# EAGLE board Zuino XS PsyFi32 (EAGLE 8.4.1), part 1 of 2
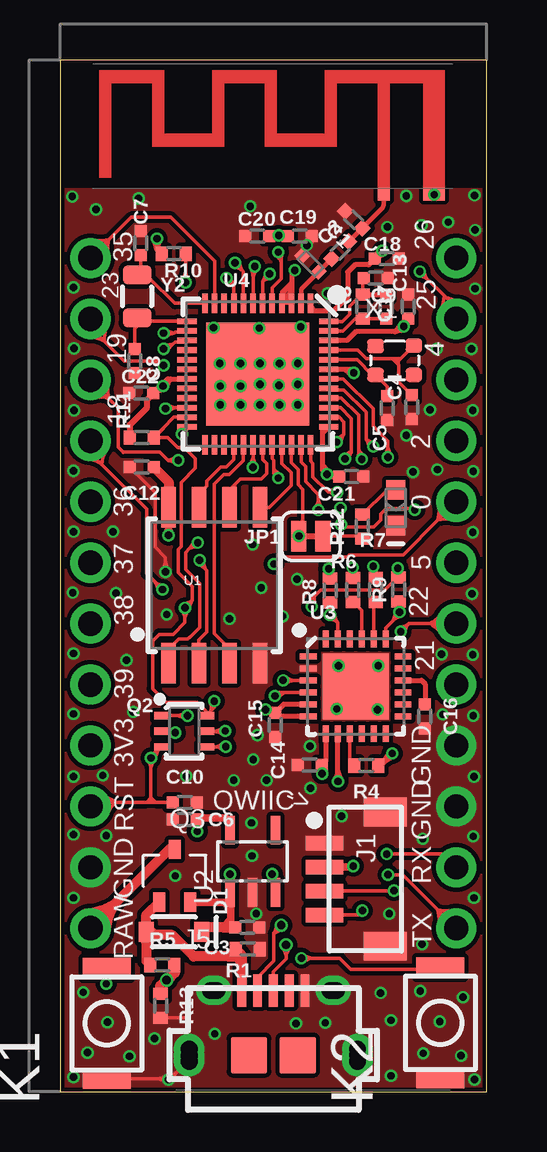
[diagram p1: board, top side]
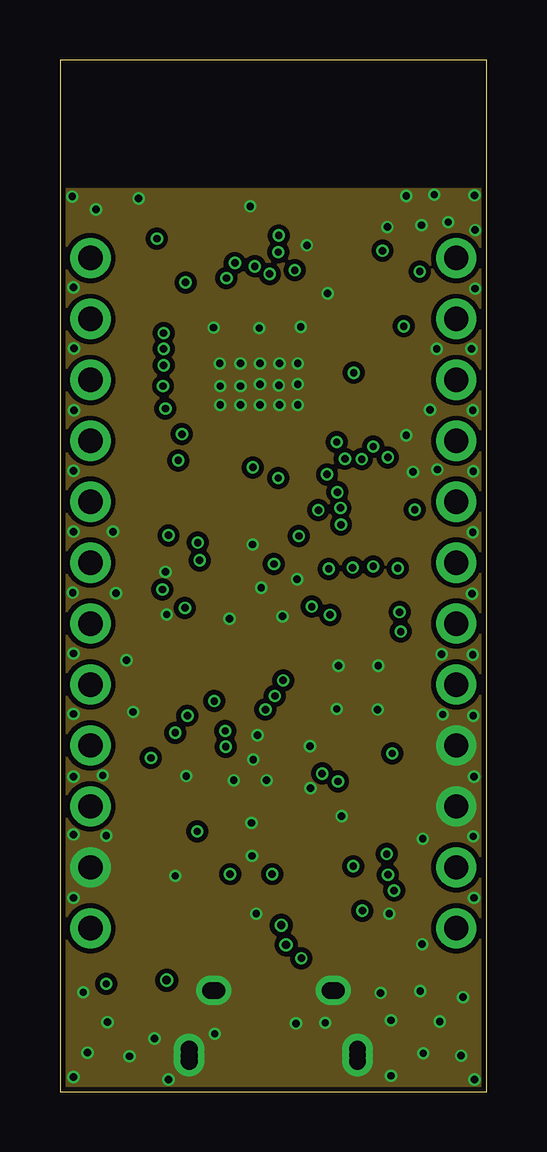
[diagram p2: board, inner layer Route2]
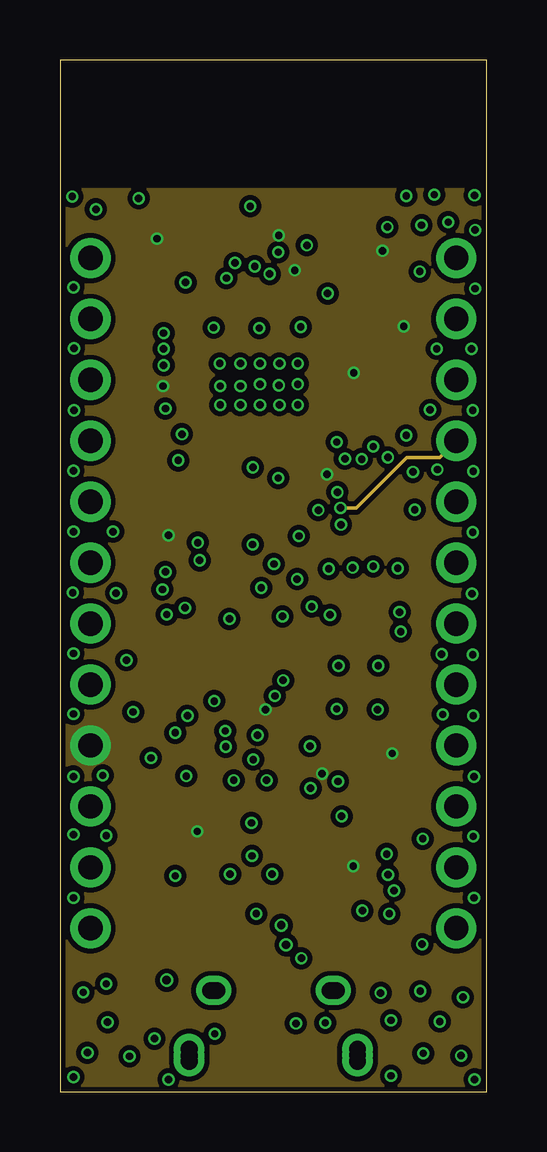
[diagram p3: board, inner layer Route15]
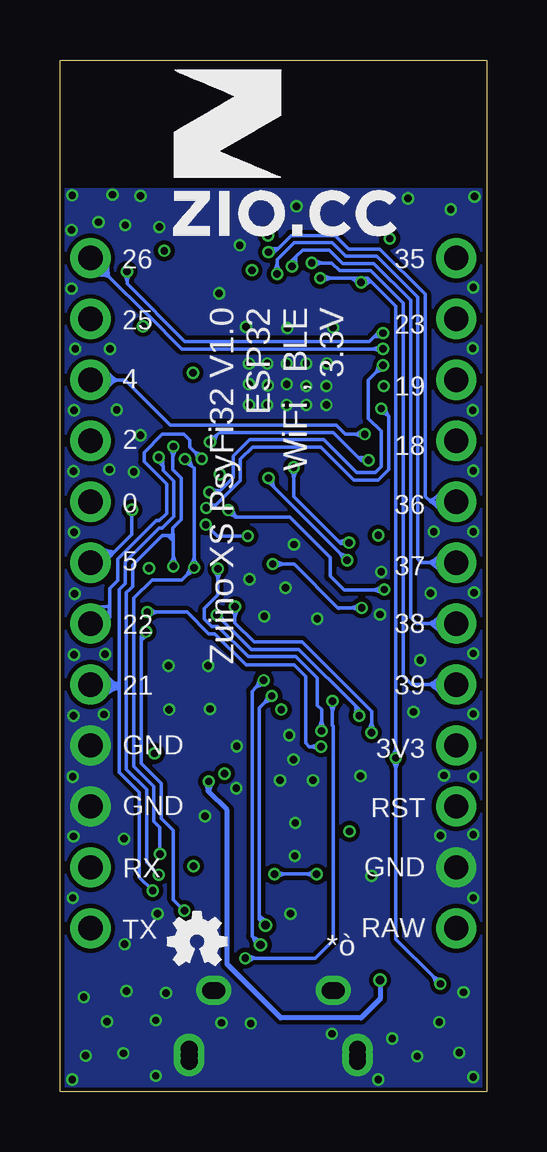
[diagram p4: board, bottom side, seen from below]

Size 17.78 x 43.01 mm. Coordinates in mm from the lower left corner, seen from the top.
Outline: 0,0 17.78,0 17.78,43.01 0,43.01 0,0
Copper layers (1*2+15*16): Top 0.035mm / dielectric 0.12mm / Route2 0.0175mm / dielectric 1.2mm / Route15 0.0175mm / dielectric 0.12mm / Bottom 0.035mm
Design rules "Eagle Rule_4layer": minimum track width 6mil, minimum drill 12mil, track to track 6mil, track to pad 6mil, pad to pad 6mil, via to via 6mil, smd to smd 0mil, copper to edge 6mil, drill to drill 12mil, minimum pad ring 10mil, minimum via ring 4mil, stop-mask expansion 2mil, vias tented up to drill 25mil, thermal gap 10mil
tRestrict: 4 lines

## Footprints (pad centres in the part's own frame; a part is rotated, then mirrored left to right if it is on the bottom)
YAGEO_C_0402 = smd 0.5 x 0.5: 1 -0.5,0; 2 0.5,0
SOD-323 = smd 0.63 x 0.83: A 1.15,0; C -1.15,0
LED_HSMH-C190 = smd 0.8 x 0.8: 1 0.75,0; 2 -0.75,0
ANTENNA_ESP32 = smd 0.5 x 0.5: ANT 5.61,-2.49 | smd 0.9 x 0.5: GND 7.71,-2.49
JST-SH-4P-90 = smd 0.6 x 1.55: 1 -1.5,0; 2 -0.5,0; 3 0.5,0; 4 1.5,0 | smd 1.2 x 1.8: 5 -2.8,2.525; 6 2.8,2.525
1X12 = drill 1.016 pad 1.676: 1 0,0; 2 2.54,0; 3 5.08,0; 4 7.62,0; 5 10.16,0; 6 12.7,0; 7 15.24,0; 8 17.78,0; 9 20.32,0; 10 22.86,0; 11 25.4,0; 12 27.94,0
MICRO-SMD = smd 0.406 x 1.346: D+ 0,2.057; D- -0.66,2.057; GND 1.321,2.057; ID 0.66,2.057; VBUS -1.321,2.057 | drill 0.7: S1 -2.489,2.057; S1@1 -2.616,2.057; S1@2 -2.362,2.057; S2 2.464,2.057; S2@1 2.362,2.057; S2@2 2.616,2.057 | drill 0.7 pad 1.27: S3 -3.505,-0.66; S3@1 -3.505,-0.381; S3@2 -3.505,-0.889; S4 3.505,-0.635; S4@1 3.505,-0.381; S4@2 3.505,-0.889 | smd 1.524 x 1.524: S5 -1.016,-0.635; S6 1.016,-0.635
SMT-JUMPER_2_NC_TRACE_SILK = smd 0.635 x 1.27: 1 -0.508,0; 2 0.508,0
SKRKAEE020 = smd 0.87 x 2: 1 -2.3,0; 2 2.3,0
INDUCTOR_HK10052N7S-T = smd 0.45 x 0.5: 1 -0.475,0; 2 0.475,0
SC70-6 = smd 0.3 x 0.66: 1 -0.65,-0.92; 2 0,-0.92; 3 0.65,-0.92; 4 0.65,0.92; 5 0,0.92; 6 -0.65,0.92
SOT-323 = smd 0.5 x 0.8: 1 0.65,0; 2 -0.65,0; 3 0,-2.2
YAGEO_R_0402 = smd 0.5 x 0.6: 1 -0.5,0; 2 0.5,0
SOIC-8 = smd 0.61 x 1.702: 1 -1.905,-3.251; 2 -0.635,-3.251; 3 0.635,-3.251; 4 1.905,-3.251; 5 1.905,3.251; 6 0.635,3.251; 7 -0.635,3.251; 8 -1.905,3.251
SOT23-5 = smd 0.4 x 1.2: 1 -0.95,-1.3; 2 0,-1.3; 3 0.95,-1.3; 4 0.95,1.3; 5 -0.95,1.3
QFN24-CP2104 = smd 0.7 x 0.25: 1 -1.975,1.25; 2 -1.975,0.75; 3 -1.975,0.25; 4 -1.975,-0.25; 5 -1.975,-0.75; 6 -1.975,-1.25; 13 1.975,-1.25; 14 1.975,-0.75; 15 1.975,-0.25; 16 1.975,0.25; 17 1.975,0.75; 18 1.975,1.25 | smd 0.25 x 0.7: 7 -1.25,-1.975; 8 -0.75,-1.975; 9 -0.25,-1.975; 10 0.25,-1.975; 11 0.75,-1.975; 12 1.25,-1.975; 19 1.25,1.975; 20 0.75,1.975; 21 0.25,1.975; 22 -0.25,1.975; 23 -0.75,1.975; 24 -1.25,1.975 | smd 2.75 x 2.75: 25 0,0
QFN48-0.4MM = smd 0.8 x 0.23: 1 -2.95,2.2; 2 -2.95,1.8; 3 -2.95,1.4; 4 -2.95,1; 5 -2.95,0.6; 6 -2.95,0.2; 7 -2.95,-0.2; 8 -2.95,-0.6; 9 -2.95,-1; 10 -2.95,-1.4; 11 -2.95,-1.8; 12 -2.95,-2.2; 25 2.95,-2.2; 26 2.95,-1.8; 27 2.95,-1.4; 28 2.95,-1; 29 2.95,-0.6; 30 2.95,-0.2; 31 2.95,0.2; 32 2.95,0.6; 33 2.95,1; 34 2.95,1.4; 35 2.95,1.8; 36 2.95,2.2 | smd 0.23 x 0.8: 13 -2.2,-2.95; 14 -1.8,-2.95; 15 -1.4,-2.95; 16 -1,-2.95; 17 -0.6,-2.95; 18 -0.2,-2.95; 19 0.2,-2.95; 20 0.6,-2.95; 21 1,-2.95; 22 1.4,-2.95; 23 1.8,-2.95; 24 2.2,-2.95; 37 2.2,2.95; 38 1.8,2.95; 39 1.4,2.95; 40 1,2.95; 41 0.6,2.95; 42 0.2,2.95; 43 -0.2,2.95; 44 -0.6,2.95; 45 -1,2.95; 46 -1.4,2.95; 47 -1.8,2.95; 48 -2.2,2.95 | smd 4.3 x 4.3: EP 0,0
4P-SMD-2X1.6MM = smd 0.7 x 0.6: 1 -0.8,0.6; 2 -0.8,-0.6; 3 0.8,-0.6; 4 0.8,0.616
CRYSTAL_2012 = smd 0.8 x 1.2: 1 -0.9,0; 2 0.9,0

## Placement (x,y rotation side)
C1  2.4pF ±0.1pF 50V  [YAGEO_C_0402]  12.24,36.34 135 top
C2  5.6pF ±0.1pF 50V  [YAGEO_C_0402]  11.68,35.08 225 top
C3  1uF ±10% 16V  [YAGEO_C_0402]  7.8,6.86 0 top
C4  10pF ±5% 50V  [YAGEO_C_0402]  14.65,28.55 270 top
C5  10pF ±5% 50V  [YAGEO_C_0402]  13.64,28.5 270 top
C6  1uF ±10% 16V  [YAGEO_C_0402]  5.19,11.34 180 top
C7  15pF ±5% 50V  [YAGEO_C_0402]  3.36,35.38 90 top
C8  15pF ±5% 50V  [YAGEO_C_0402]  3.12,30.46 270 top
C9  10nF ±10% 50V  [YAGEO_C_0402]  13.17,33.92 0 top
C10  10uF ±20% 10V  [YAGEO_C_0402]  5.19,12.06 0 top
C12  0.1uF ±10% 50V  [YAGEO_C_0402]  3.4,26.04 180 top
C13  3nF ±10% 50V  [YAGEO_C_0402]  13.59,32.72 270 top
C14  0.1uF ±10% 50V  [YAGEO_C_0402]  10.41,13.61 180 top
C15  2.2uF ±10% 10V  [YAGEO_C_0402]  8.97,15.29 270 top
C16  4.7uF ±10% 10V  [YAGEO_C_0402]  15.19,15.65 270 top
C17  100pF ±5% 50V  [YAGEO_C_0402]  14.51,32.72 90 top
C18  0.1uF ±10% 50V  [YAGEO_C_0402]  13.62,34.72 0 top
C19  0.1uF ±10% 50V  [YAGEO_C_0402]  9.98,35.66 0 top
C20  10uF ±20% 20V  [YAGEO_C_0402]  8.23,35.67 180 top
C21  0.1uF ±10% 50V  [YAGEO_C_0402]  12.15,25.64 0 top
C22  0.1uF ±10% 50V  [YAGEO_C_0402]  3.4,29.11 180 top
D1  B5817WS-SJ  [SOD-323]  4.75,6.65 180 top
D2  RLED  [LED_HSMH-C190]  14,24.34 270 top
E1  ANTENNA-GROUNDED  [ANTENNA_ESP32]  7.87,39.89 0 top
J1  JST-SH-4P  [JST-SH-4P-90]  11.02,8.86 270 top
J3  [1X12]  1.27,34.75 270 top
J4  [1X12]  16.51,34.75 270 top
J5  U-F-M5DD-Y-L  [MICRO-SMD]  8.89,2.16 0 top
JP1  JUMPER-SMT_2_NC_TRACE_SILK  [SMT-JUMPER_2_NC_TRACE_SILK]  10.45,23.15 0 top
K1  [SKRKAEE020]  1.96,2.84 90 top
K2  [SKRKAEE020]  15.85,2.87 90 top
L1  2.7nH ±0.3nH  [INDUCTOR_HK10052N7S-T]  10.44,34.52 135 top
Q2  MBT3904DW1T1G  [SC70-6]  5.17,15.02 270 top
Q3  [SOT-323]  4.78,7.9 180 top
R1  10k ±1%  [YAGEO_R_0402]  7.82,5.94 180 top
R3  20k ±1%  [YAGEO_R_0402]  12.61,32.72 270 top
R4  10k ±1%  [YAGEO_R_0402]  12.75,13.59 180 top
R5  24k ±1%  [YAGEO_R_0402]  4.27,5.28 0 top
R6  1k ±1%  [YAGEO_R_0402]  12.2,20.92 270 top
R7  1k ±1%  [YAGEO_R_0402]  13.16,20.92 270 top
R8  10k ±1%  [YAGEO_R_0402]  11.25,20.89 90 top
R9  10k ±1%  [YAGEO_R_0402]  14.11,20.93 90 top
R10  10k ±1%  [YAGEO_R_0402]  4.75,34.92 180 top
R11  10k ±1%  [YAGEO_R_0402]  3.4,27.27 180 top
R12  1k ±1%  [YAGEO_R_0402]  12.6,23.55 90 top
R13  47k ±1%  [YAGEO_R_0402]  4.19,3.58 270 top
U1  W25Q32FVSSIGTR  [SOIC-8]  6.43,21.11 0 top
U2  XC6210B332MR  [SOT23-5]  8.03,9.6 0 top
U3  CP2104-F03-GM  [QFN24-CP2104]  12.32,16.89 0 top
U4  ESP3212  [QFN48-0.4MM]  8.24,29.91 270 top
U$1  [SPARKFUN-AESTHETICS_OSHW-LOGO-MINI]  12.06,6.27 0 bottom
U$18  [7MM]  -1.74,40.4 0 bottom
X1  26MHz  [4P-SMD-2X1.6MM]  13.95,30.48 0 top
Y2  32.768kHz  [CRYSTAL_2012]  3.21,33.15 270 top